# EasyEDA Pro project ProPrj_stmf4+esp32s3转接板_2025-01-29.epro, schematic Schematic1
Board Name: ESP32-S3; Create Date: 2024-12-17; Page Name: P1; Project Name: stmf4+esp32s3转接板; Schematic Name: Schematic1; Update Date: 2025-01-27; Company: 嘉立创EDA; Page Size: A4; Version: V1.0
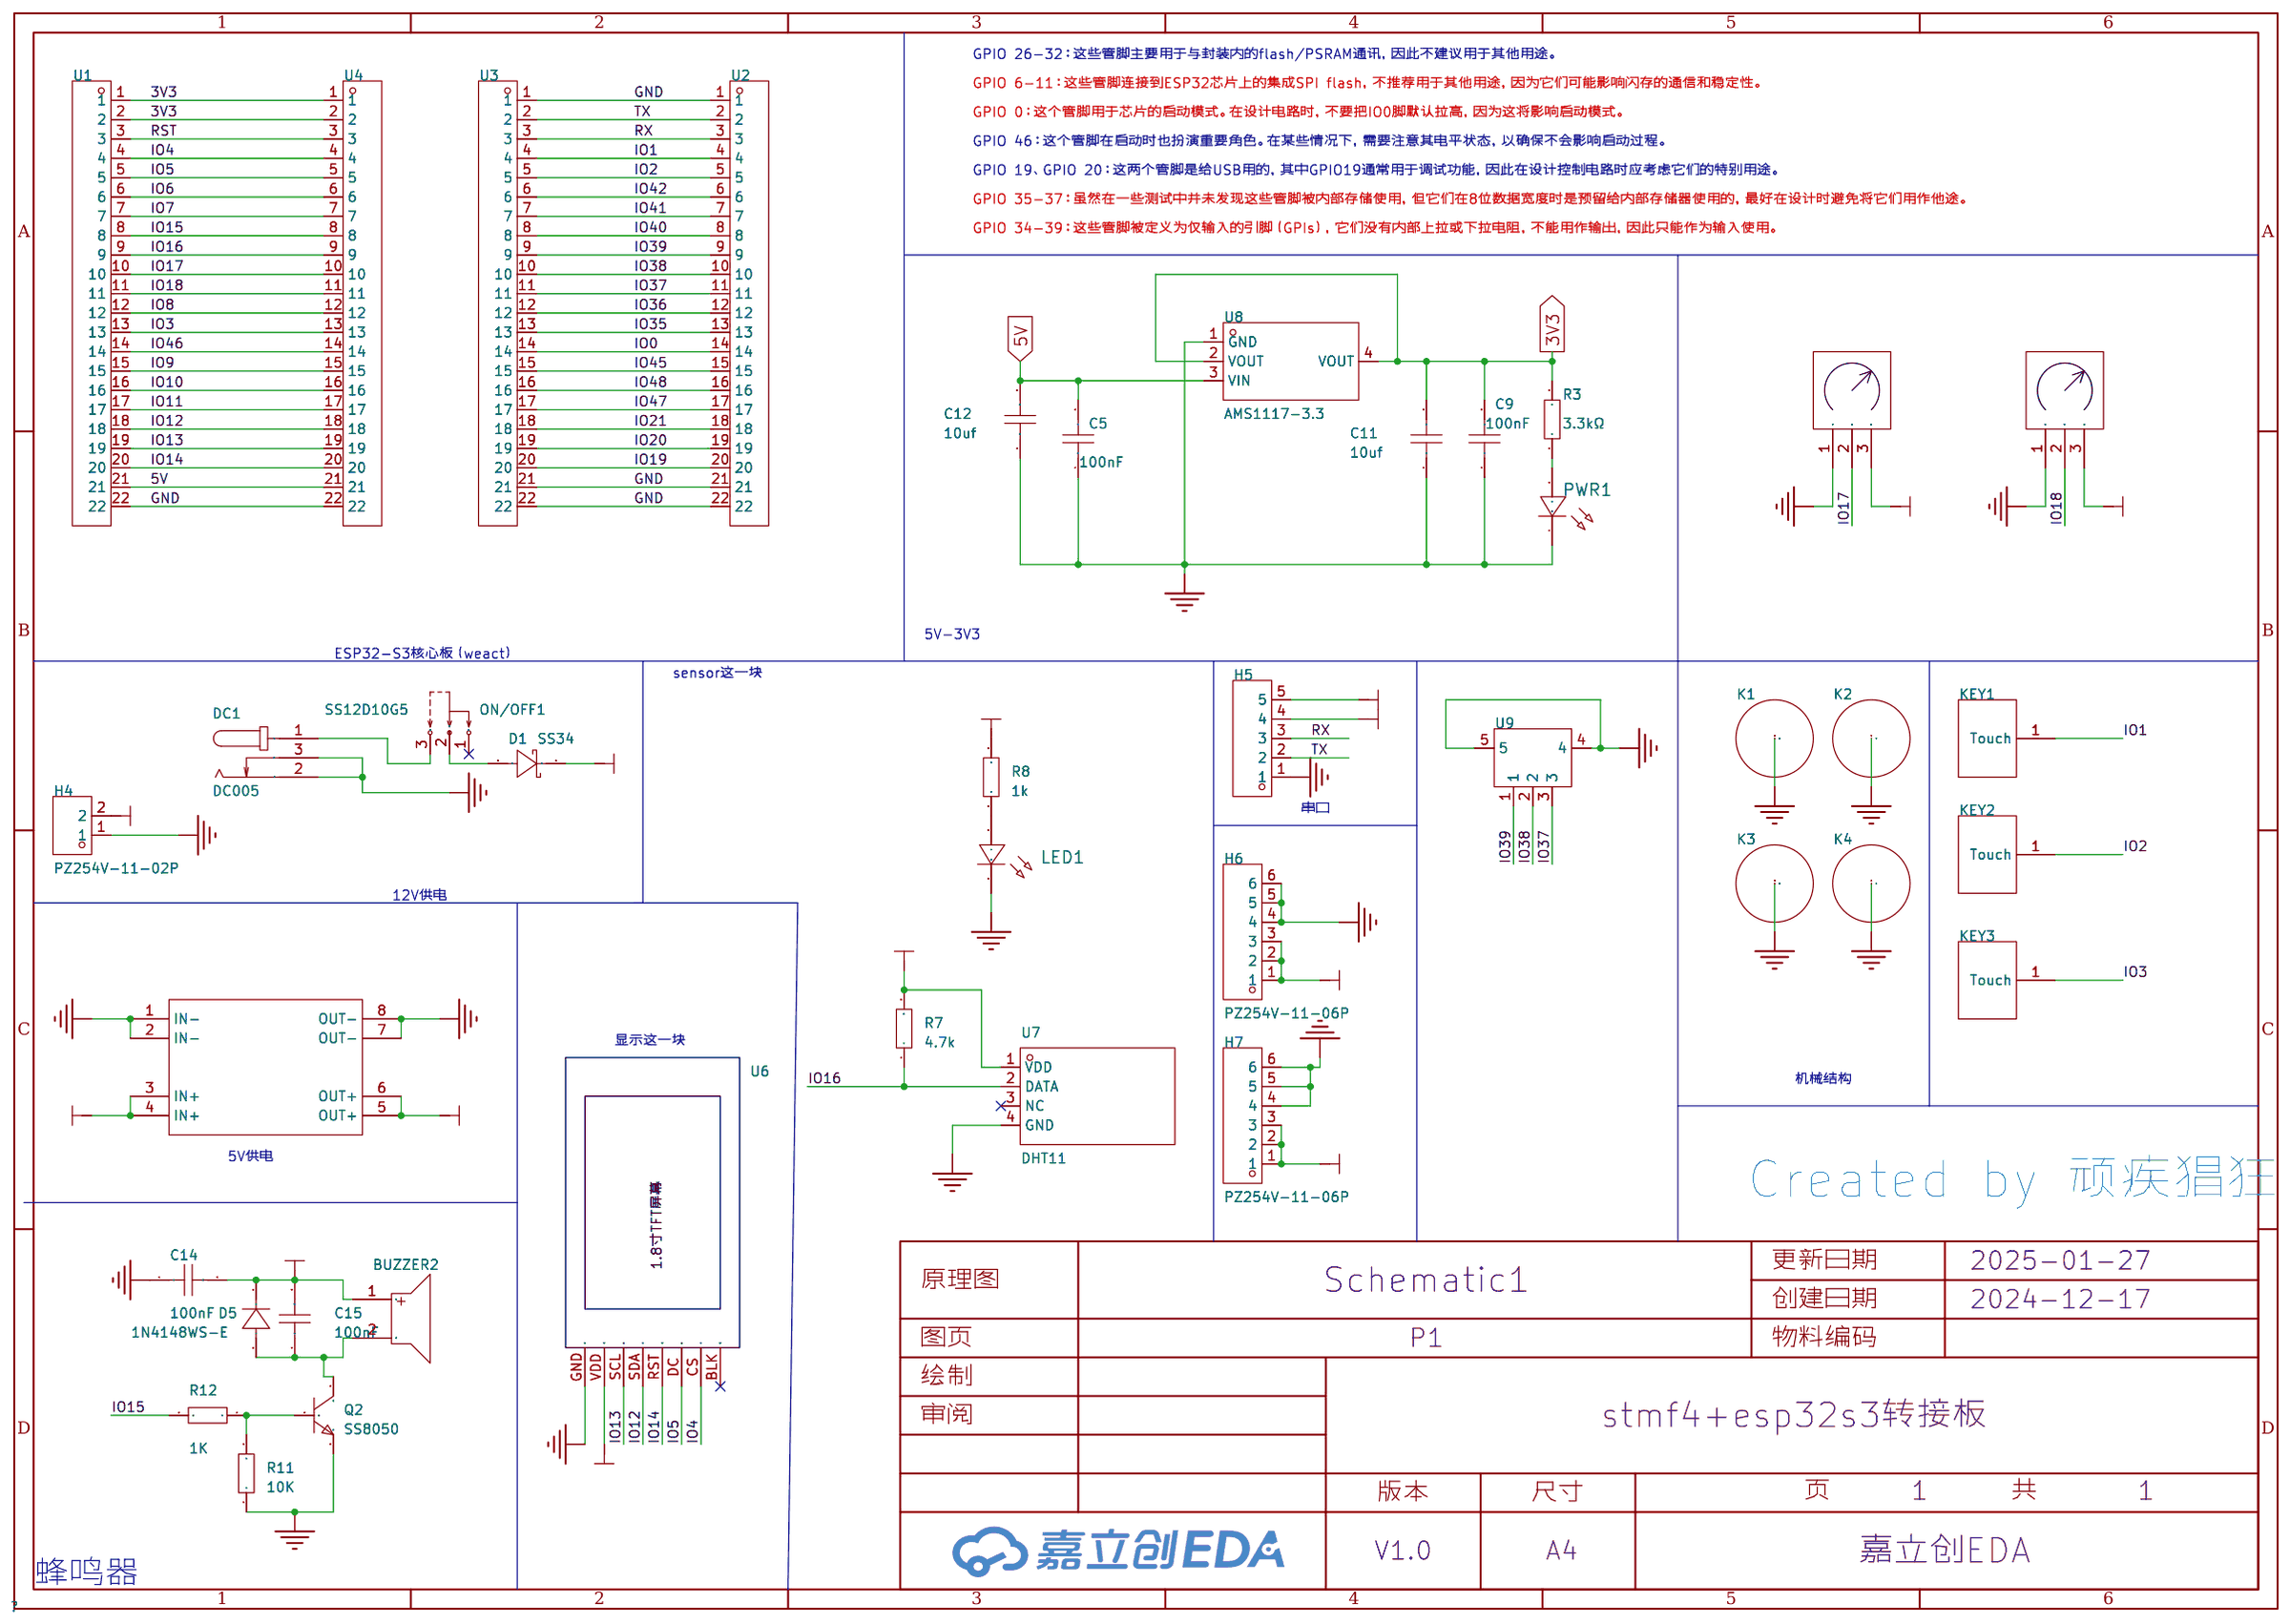
[diagram p0: schematic sheet]

## Parts
BUZZER2  2.7kHz  [BUZ-TH_BD9.0-P4.00-D0.6-FD]
C5  100nF  [C0603]
C9  100nF  [C0805]
C11  10uf  [C0805]
C12  10uf  [C0805]
C14  100nF  [C0603]
C15  100nF  [C0603]
D1  SS34  [SMA_L4.3-W2.5-LS5.0-RD]
D5  1N4148WS-E  [SOD-323_L1.8-W1.3-LS2.5-RD]
DC1  DC005  [DC-IN-TH_DC005]
H4  PZ254V-11-02P  [HDR-TH_2P-P2.54-V-M]
H5  PZ254V-11-05P  [HDR-TH_5P-P2.54-V-M]
H6  PZ254V-11-06P  [HDR-TH_6P-P2.54-V-M]
H7  PZ254V-11-06P  [HDR-TH_6P-P2.54-V-M]
K1  -  [125 X 300]
K2  -  [125 X 300]
K3  -  [125 X 300]
K4  -  [125 X 300]
KEY1  -  [ESP32触摸引脚焊盘]
KEY2  -  [ESP32触摸引脚焊盘]
KEY3  -  [ESP32触摸引脚焊盘]
LED1  -  [LED_0603]
ON/OFF1  SS12D10G5  [SW-TH_SHOU-HAN_SS12D10G4]
PWR1  -  [LED_0603]
Q2  SS8050  [SOT-23-3_L2.9-W1.3-P1.90-LS2.4-BR]
R3  3.3kΩ  [R0603]
R7  4.7k  [R0603]
R8  1k  [R0603]
R11  10K  [R0603]
R12  1K  [R0603]
RP1  卧式电位器  [卧式电位器]
RP2  卧式电位器  [卧式电位器]
U1  ZX-PM2.54-1-22PY  [HDR-TH_22P-P2.54-V-F]
U2  ZX-PM2.54-1-22PY  [HDR-TH_22P-P2.54-V-F]
U3  ZX-PM2.54-1-22PY  [HDR-TH_22P-P2.54-V-F]
U4  ZX-PM2.54-1-22PY  [HDR-TH_22P-P2.54-V-F]
U5  MP1584EN模块  [MP1548EN可调电源模块]
U6  -  [1.8寸TFT屏幕]
U7  DHT11  [SENSOR-TH_DHT11]
U8  AMS1117-3.3  [SOT-223-3_L6.5-W3.4-P2.30-LS7.0-BR]
U9  QS-301-AGS5P  [SW-SMD_QS-301-AGS5P]

## Library data of the parts
BUZZER2 = QMB-09B-03: 驱动方式:无源(外部驱动);构造类型:电磁式;频率:2.7kHz;声压(SPL):85dB@3V,10cm;; LCSC Part Name: 无源蜂鸣器QMB-09B-03; Supplier Part: C96256; Manufacturer: 华能; Supplier Footprint: 插件,D=9mm; JLCPCB Part Class: 扩展库; Datasheet: https://atta.szlcsc.com/upload/public/pdf/source/20210401/C96256_958B17753B5AD7CBFBCFFC7C095B4484.pdf; Supplier: LCSC; Oscillator Circuit: 无源(外部驱动); Technology Type: 电磁式; Operating Voltage: 2V~5V; Sound Pressure Level (SPL): 85dB@3V,10cm; Diameter (φD): 9mm; Height: 5.7mm
C5 = CL10B104KB8NNNC: 容值:100nF;精度:±10%;额定电压:50V;材质(温度系数):X7R;; LCSC Part Name: 100nF ±10% 50V; Supplier Part: C1591; Manufacturer: SAMSUNG(三星); Supplier Footprint: 0603; JLCPCB Part Class: 扩展库; Datasheet: https://atta.szlcsc.com/upload/public/pdf/source/20160218/1457707763339.pdf; Supplier: LCSC; Tolerance: ±10%; Voltage Rated: 50V; Temperature Coefficient: X7R
C9 C11 C12 = CAP_0805: Supplier Footprint: 0805
C14 C15 = CAP_0603: Supplier Footprint: 0603
D1 = SS34_C727060: 二极管配置:独立式;正向压降(Vf):550mV@3A;直流反向耐压(Vr):40V;平均整流电流(Io):3A;; LCSC Part Name: 电压:40V 电流:3A; Supplier Part: C727060; Manufacturer: TWGMC(台湾迪嘉); Supplier Footprint: SMA(DO-214AC); JLCPCB Part Class: 扩展库; Datasheet: https://atta.szlcsc.com/upload/public/pdf/source/20200828/C727059_6599B6CAC5F3238B9C33E46794659DBE.pdf; Supplier: LCSC; Diode Configuration: 独立式; Forward Voltage (Vf@If): 550mV@3A; Reverse Voltage (Vr): 40V; Average Rectified Current (Io): 3A; Reverse Leakage Current (Ir): 500uA@40V
D5 = 1N4148WS-E: 二极管配置:-;正向压降(Vf):-;直流反向耐压(Vr):-;; LCSC Part Name: 开关二极管; Supplier Part: C41371421; Manufacturer: MDD(辰达半导体); Supplier Footprint: SOD-323; Datasheet: https://atta.szlcsc.com/upload/public/pdf/source/20240830/BA1E56105C5798AA4D5522D8577BF8A0.pdf; Supplier: LCSC
DC1 = DC005: 连接器类型:DC电源插座;安装方式:弯插;触点内径:2mm;触点外径:6.3mm;额定电流:500mA;额定电压:30V;工作温度范围:-40℃~+55℃;; LCSC Part Name: DC电源插座 内径:2mm 外径:6.3mm; Supplier Part: C431533; Manufacturer: SHOU HAN(首韩); Supplier Footprint: 插件; Datasheet: https://atta.szlcsc.com/upload/public/pdf/source/20190925/C431533_4751811035784AC1D38EBC85F7905E99.pdf; Supplier: LCSC; Connector Type: DC电源插座; Mounting Style: 弯插; Inside Contact Diameter: 2mm; Outside Contact Diameter: 6.3mm; Current Rating (Max): 500mA; Voltage Rating (Max): 30V; Operating Temperature Range: -40℃~+55℃
H4 = PZ254V-11-02P: 插针结构:1x2P;间距:2.54mm;行距:-;圆针/方针:方针;安装类型:直插;排数:单排;总PIN位数:2P;额定电流:-;额定电压:-;配合针长度:6mm;塑高:2.5mm;端接针长度:3mm;触头材质:黄铜;触头镀层:-;工作温度范围:-40℃~+105℃;颜色:黑色;; LCSC Part Name: 间距:2.54mm 1x2P 直插 方针; Supplier Part: C492401; Manufacturer: XFCN(兴飞); Supplier Footprint: 插件,P=2.54mm; JLCPCB Part Class: 扩展库; Datasheet: https://atta.szlcsc.com/upload/public/pdf/source/20200309/C492401_A812433581A9B211A7FFA413ADDFF0E5.pdf; Supplier: LCSC; Pin Structure: 1x2P; Pitch: 2.54mm; Circluar Pins/Square Pins: 方针; Mounting Type: 直插; Number of Rows: 单排; Number of Pins: 2P; Length of Mating Pin: 6mm; Insulation Height: 2.5mm; Length of End Connection Pin: 3mm; Contact Material: 黄铜; Operating Temperature Range: -40℃~+105℃; Color: 黑色
H5 = PZ254V-11-05P: 插针结构:1x5P;间距:2.54mm;行距:-;圆针/方针:方针;安装类型:直插;排数:单排;总PIN位数:5P;额定电流:-;额定电压:-;配合针长度:6mm;塑高:2.5mm;端接针长度:3mm;触头材质:黄铜;触头镀层:-;工作温度范围:-40℃~+105℃;颜色:黑色;; LCSC Part Name: 间距:2.54mm 1x5P 直插 方针; Supplier Part: C492404; Manufacturer: XFCN(兴飞); Supplier Footprint: 插件,P=2.54mm; JLCPCB Part Class: 扩展库; Datasheet: https://atta.szlcsc.com/upload/public/pdf/source/20200309/C492404_E51533260F8710EFF5D4617281164C1D.pdf; Supplier: LCSC; Pin Structure: 1x5P; Pitch: 2.54mm; Circluar Pins/Square Pins: 方针; Mounting Type: 直插; Number of Rows: 单排; Number of Pins: 5P; Length of Mating Pin: 6mm; Insulation Height: 2.5mm; Length of End Connection Pin: 3mm; Contact Material: 黄铜; Operating Temperature Range: -40℃~+105℃; Color: 黑色
H6 H7 = PZ254V-11-06P: 插针结构:1x6P;间距:2.54mm;行距:-;圆针/方针:方针;安装类型:直插;排数:单排;总PIN位数:6P;额定电流:-;额定电压:-;配合针长度:6mm;塑高:2.5mm;端接针长度:3mm;触头材质:黄铜;触头镀层:-;工作温度范围:-40℃~+105℃;颜色:黑色;; LCSC Part Name: 间距:2.54mm 1x6P 直插 方针; Supplier Part: C492405; Manufacturer: XFCN(兴飞); Supplier Footprint: 插件,P=2.54mm; JLCPCB Part Class: 扩展库; Datasheet: https://atta.szlcsc.com/upload/public/pdf/source/20200309/C492405_597F1930F5B55CC3C7FD95458F1C3977.pdf; Supplier: LCSC; Pin Structure: 1x6P; Pitch: 2.54mm; Circluar Pins/Square Pins: 方针; Mounting Type: 直插; Number of Rows: 单排; Number of Pins: 6P; Length of Mating Pin: 6mm; Insulation Height: 2.5mm; Length of End Connection Pin: 3mm; Contact Material: 黄铜; Operating Temperature Range: -40℃~+105℃; Color: 黑色
K1-K4 = 125 X 300
KEY1-KEY3 = ESP32_TouchPad
LED1 PWR1 = LED_0603-R: Supplier Footprint: 0603
ON/OFF1 = SS12D10G5: 电路结构:单刀双掷;安装方式:直插;额定电流(DC):2A;额定电压(DC):125V;机械寿命:3千次;; LCSC Part Name: 两档立式插件 3脚拨动开关 柄长5.0mm; Supplier Part: C7431054; Manufacturer: SHOU HAN(首韩); Supplier Footprint: 插件; JLCPCB Part Class: 扩展库; Datasheet: https://atta.szlcsc.com/upload/public/pdf/source/20231130/7A3DB6A149BF0A1DCFFE64FFC07FE434.pdf; Supplier: LCSC; Circuit: 单刀双掷; Switch Length: 12.7mm; Switch Width: 6.7mm; Mounting Style: 直插; Current Rating (DC): 2A; Voltage Rating (DC): 125V; Mechanical Life: 3千次; Operating Temperature: -25℃~+70℃
Q2 = SS8050_C2150: 晶体管类型:NPN;集电极电流(Ic):1.5A;集射极击穿电压(Vceo):25V;功率(Pd):300mW;直流电流增益(hFE@Ic,Vce):200@100mA,1V;; LCSC Part Name: SS8050(RANGE:200-350) hfe=200~350; Supplier Part: C2150; Manufacturer: CJ(江苏长电/长晶); Supplier Footprint: SOT-23; JLCPCB Part Class: 基础库; Datasheet: https://atta.szlcsc.com/upload/public/pdf/source/20230322/AEE86F4B043774EFF80CAEA14A37D9E9.pdf; Supplier: LCSC; Transistor Type: NPN; Collector Current (Ic): 1.5A; Collector-Emitter Breakdown Voltage (Vceo): 25V; Power Dissipation (Pd): 300mW; DC Current Gain (hFE@Ic,Vce): 200@100mA,1V; Transition Frequency (fT): 100MHz; Collector Cut-Off Current (Icbo): 100nA; Collector-Emitter Saturation Voltage (VCE(sat)@Ic,Ib): 500mV@800mA,80mA
R3 = 0603WAF3301T5E: 电阻类型:厚膜电阻;阻值:3.3kΩ;精度:±1%;功率:100mW;最大工作电压:75V;温度系数:±100ppm/℃;; LCSC Part Name: 3.3kΩ ±1% 100mW 厚膜电阻; Supplier Part: C22978; Manufacturer: UNI-ROYAL(厚声); Supplier Footprint: 0603; JLCPCB Part Class: 基础库; Datasheet: https://atta.szlcsc.com/upload/public/pdf/source/20200306/C422600_1E6D84923E4A46A82E41ADD87F860B5C.pdf; Supplier: LCSC; Type: 厚膜电阻; Tolerance: ±1%; Power(Watts): 100mW; Overload Voltage (Max): 75V; Temperature Coefficient: ±100ppm/℃; Operating Temperature Range: -55℃~+155℃
R7 R8 R11 R12 = Res_0603: Supplier Footprint: 0603
RP1 RP2 = 卧式电位器
U1-U4 = ZX-PM2.54-1-22PY: 插孔结构:1x22P;间距:2.54mm;行距:-;圆孔/方孔:方孔;安装类型:直插;排数:单排;总孔位数:22P;额定电流:-;额定电压:1kV;插孔方向:顶部;塑高:8.5mm;触头材质:-;触头镀层:金;工作温度范围:-40℃~+105℃;焊接温度(最大值):260℃@5S;; LCSC Part Name: 1x22P 间距:2.54mm 直插; Supplier Part: C7499337; Manufacturer: Megastar(兆星); Supplier Footprint: 插件,P=2.54mm; JLCPCB Part Class: 扩展库; Datasheet: https://atta.szlcsc.com/upload/public/pdf/source/20231122/9A7AD1561672B326C4FDCF441604BC5A.pdf; Supplier: LCSC; Holes Structure: 1x22P; Pitch: 2.54mm; Circular Hole / Square Hole: 方孔; Mounting Type: 直插; Number of Rows: 单排; Number of Holes: 22P; Voltage Rating (Max): 1kV; Holes Direction: 顶部; Insulation Height: 8.5mm; Contact Plating: 金; Operating Temperature Range: -40℃~+105℃; Soldering Temperature(Max): 260℃@5S
U5 = MP1584EN模块
U6 = 1.8寸TFT彩屏
U7 = DHT11: 新款电容式数字温湿度传感器,老款已停产16.1x12.6x5.8mm; LCSC Part Name: DHT11  电容式传感器 新款电容式数字温湿度传感器,老款已停产16.1x12.6x5.8mm; Supplier Part: C117051; Manufacturer: 广州奥松; Supplier Footprint: SIP-4; JLCPCB Part Class: 扩展库; Datasheet: https://atta.szlcsc.com/upload/public/pdf/source/20170703/1499081238365.pdf; Supplier: LCSC
U8 = AMS1117-3.3_C6186: 3V3; LCSC Part Name: 3V3; Supplier Part: C6186; Manufacturer: AMS; Supplier Footprint: SOT-223; JLCPCB Part Class: 基础库; Datasheet: https://atta.szlcsc.com/upload/public/pdf/source/20180727/C6186_7A095716F0823C02F1997A905E26C086.pdf; Supplier: LCSC; Output Type: 固定; Output Voltage: 3V3; MAX Output Current: 1A; Power Supply Rejection Ratio (PSRR): 72dB@(120Hz); Dropout Voltage: 1.3V@(800mA); Output Polarity: 正极; Number of Outputs: 1
U9 = QS-301-AGS5P: 三脚 大头拨轮多功能开关 MP3/MP4换曲按键; LCSC Part Name: 三脚 大头拨轮多功能开关 MP3/MP4换曲按键; Supplier Part: C42377853; Manufacturer: XUNPU(讯普); Supplier Footprint: SMD; Datasheet: https://atta.szlcsc.com/upload/public/pdf/source/20241106/28956C8F7821B982CBB1BD5B1BCE3D5A.pdf; Supplier: LCSC

## Nets
3V3: C9.2 C11.2 H5.4 H7.1 H7.2 H7.3 R3.2 R7.2 R8.2 RP1.3 RP2.3 U1.1 U1.2 U4.1 U4.2 U6.VDD(2) U7.1(VDD) U8.2(VOUT) U8.4(VOUT)
5V: BUZZER2.1 C5.2 C12.2 C14.2 C15.2 D5.1(K) H5.5 H6.1 H6.2 H6.3 U1.21 U4.21 U5.5(OUT+) U5.6(OUT+) U8.3(VIN)
12V: D1.1(C) H4.2 U5.3(IN+) U5.4(IN+)
GND: C5.1 C9.1 C11.1 C12.1 C14.1 DC1.2 DC1.3 H4.1 H5.1 H6.4 H6.5 H6.6 H7.4 H7.5 H7.6 K1.1 K2.1 K3.1 K4.1 LED1.1(C) PWR1.1(C) Q2.2(E) R11.1 RP1.1 RP2.1 U1.22 U2.1 U2.21 U2.22 U3.1 U3.21 U3.22 U4.22 U5.1(IN-) U5.2(IN-) U5.7(OUT-) U5.8(OUT-) U6.GND(1) U7.4(GND) U8.1(GND) U9.4 U9.5
IO0: U2.14 U3.14
IO1: KEY1.1(Touch) U2.4 U3.4
IO2: KEY2.1(Touch) U2.5 U3.5
IO3: KEY3.1(Touch) U1.13 U4.13
IO4: U1.4 U4.4 U6.CS(7)
IO5: U1.5 U4.5 U6.DC(6)
IO6: U1.6 U4.6
IO7: U1.7 U4.7
IO8: U1.12 U4.12
IO9: U1.15 U4.15
IO10: U1.16 U4.16
IO11: U1.17 U4.17
IO12: U1.18 U4.18 U6.SDA(4)
IO13: U1.19 U4.19 U6.SCL(3)
IO14: U1.20 U4.20 U6.RST(5)
IO15: R12.2 U1.8 U4.8
IO16: R7.1 U1.9 U4.9 U7.2(DATA)
IO17: RP1.2 U1.10 U4.10
IO18: RP2.2 U1.11 U4.11
IO19: U2.20 U3.20
IO20: U2.19 U3.19
IO21: U2.18 U3.18
IO35: U2.13 U3.13
IO36: U2.12 U3.12
IO37: U2.11 U3.11 U9.3
IO38: U2.10 U3.10 U9.2
IO39: U2.9 U3.9 U9.1
IO40: U2.8 U3.8
IO41: U2.7 U3.7
IO42: U2.6 U3.6
IO45: U2.15 U3.15
IO46: U1.14 U4.14
IO47: U2.17 U3.17
IO48: U2.16 U3.16
RST: U1.3 U4.3
RX: H5.3 U2.3 U3.3
TX: H5.2 U2.2 U3.2
$1N4171: DC1.1 ON/OFF1.3
$1N4173: D1.2(A) ON/OFF1.2
$1N5680: LED1.2(A) R8.1
$1N6077: PWR1.2(A) R3.1
$1N10277: Q2.1(B) R11.2 R12.1
$1N10279: BUZZER2.2 C15.1 D5.2(A) Q2.3(C)

Not connected (* = marked no-connect by the designer): ON/OFF1 1*; U6 BLK(8)*; U7 3(NC)*

## Notes on the sheet
- GPIO 26-32：这些管脚主要用于与封装内的flash/PSRAM通讯，因此不建议用于其他用途。
- GPIO 6-11：这些管脚连接到ESP32芯片上的集成SPI flash，不推荐用于其他用途，因为它们可能影响闪存的通信和稳定性。
- GPIO 0：这个管脚用于芯片的启动模式。在设计电路时，不要把IO0脚默认拉高，因为这将影响启动模式。
- GPIO 46：这个管脚在启动时也扮演重要角色。在某些情况下，需要注意其电平状态，以确保不会影响启动过程。
- GPIO 19、GPIO 20：这两个管脚是给USB用的，其中GPIO19通常用于调试功能，因此在设计控制电路时应考虑它们的特别用途。
- GPIO 35-37：虽然在一些测试中并未发现这些管脚被内部存储使用，但它们在8位数据宽度时是预留给内部存储器使用的，最好在设计时避免将它们用作他途。
- GPIO 34-39：这些管脚被定义为仅输入的引脚（GPIs），它们没有内部上拉或下拉电阻，不能用作输出，因此只能作为输入使用。
- ESP32-S3核心板（weact）
- 5V-3V3
- sensor这一块
- 串口
- 12V供电
- 显示这一块
- 机械结构
- 5V供电
- Created by 顽疾猖狂
- 蜂鸣器
